# Altium schematic sheet PS.SchDoc
size A4; Author: Wojciech Grędel; Revision: 1
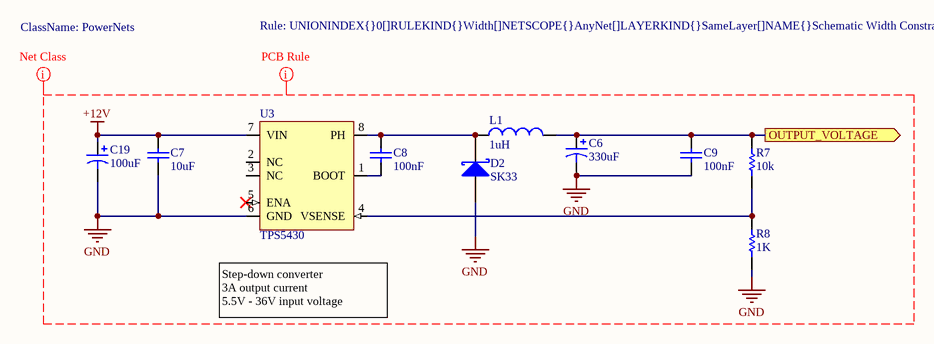
[diagram p0: PS.SchDoc]

## Parts
C6  value 330uF  [CAP_SMD_D_IPC_MD]  (hidden comment: Cap Pol)
C7  value 10uF  [CAP_0805_IPC_MD]  (hidden comment: Cap)
C8  value 100nF  [CAP_0805_IPC_MD]  (hidden comment: Cap)
C9  value 100nF  [CAP_0805_IPC_MD]  (hidden comment: Cap)
C19  value 100uF  [CAPAE7866X80M]  (hidden comment: Cap Pol)
D2  SK33  [DO214AB_IPC_MD]
L1  value 1uH  [IND_DL50_IPC_MD]  (hidden comment: Inductor)
R7  value 10k  [RES_0805_IPC_MD]  (hidden comment: Res)
R8  value 1K  [RES_0805_IPC_MD]  (hidden comment: Res)
U3  TPS5430  [SOIC_8_THERMAL_PAD_IPC_MD]

## Ports
OUTPUT_VOLTAGE (out)

## Nets
+12V: C7.2 C19.1 U3.7(VIN)
GND: C6.2 C7.1 C9.1 C19.2 D2.1(A) R8.1 U3.6(GND) U3.9(PwPd)
OUTPUT_VOLTAGE: C6.1 C9.2 L1.2 R7.2 ; port OUTPUT_VOLTAGE
NetC8_1: C8.1 U3.1(BOOT)
NetC8_2: C8.2 D2.2(K) L1.1 U3.8(PH)
NetR7_1: R7.1 R8.2 U3.4(VSENSE)

Not connected (* = marked no-connect by the designer): U3 2(NC) 3(NC) 5(ENA)*

## Layout directives
net class PowerNets: +12V, GND
rule Width Constraint [Pref Width = 25mil    Min Width = 20mil    Max Width = 30mil]: +12V, GND

## Notes on the sheet
- (near U3) Step-down converter
  3A output current
  5.5V - 36V input voltage
- Confidential / Not for distribution !
- Project name:
- Document name:
- Designer Name:
- Date/Time:
- Revision:

## Library data of the parts
C6 C19 = Cap Pol: Polarized Capacitor (Axial); Manufacturer: AVX; Published: 8-Jun-2000; LatestRevisionDate: 17-Jul-2002; LatestRevisionNote: Re-released for DXP Platform.; PackageReference: POLAR0.8; Publisher: Altium Limited; PackageDescription: Polarized Capacitor; 2 Leads; Supplier: TME; Supplier Part Number: TPSD337K006R0045
C7 = Cap: Capacitor; Manufacturer: Sansung; Supplier Part Number: CL21A106KOQNNNF; Supplier: TME
C8 C9 = Cap: Capacitor; Manufacturer: Samsung; Supplier Part Number: CL21B104KBCNNNC; Supplier: TME
D2 = SK33: Schottky Diode; Manufacturer: Diotec; ManufacturerURL: http://diotec.com/tl_files/diotec/files/pdf/datasheets/sk32; Supplier: TME; Supplier Part Number: SK33-DIO
L1 = Inductor: Manufacturer: Ferrocore; Supplier: *; Supplier Part Number: *; Isat: *; Irms: *
R7 R8 = Res: Resistor; Supplier: *; Supplier Part Number: *; Manufacturer: *
U3 = TPS5430: 3-A, Wide Input Range, Step-Down Converter; Manufacturer: Texas Instruments; Supplier: TME; Supplier Part Number: TPS5430DDAR